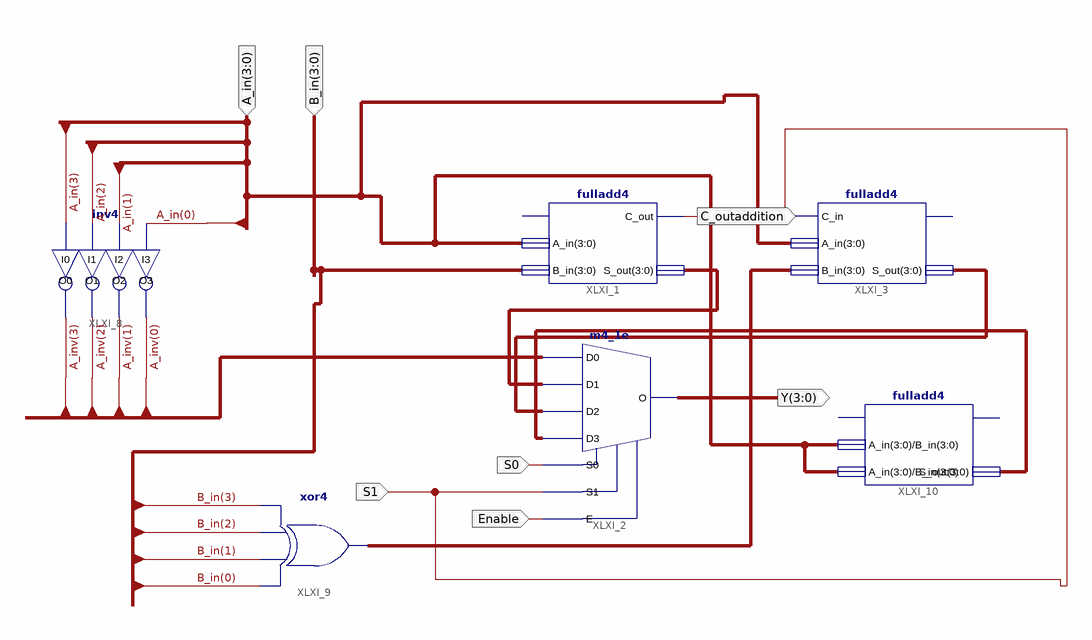
[diagram p0: schematic sheet 1]
// Xilinx ISE schematic lab1_ALU.sch (spartan6) as structural Verilog: 6 symbols, 7 ports
module lab1_ALU (
  input  [3:0] B_in,
  input  [3:0] A_in,
  input  S1,
  input  Enable,
  input  S0,
  output [3:0] Y,
  output C_outaddition
);

  wire [3:0] A_inv, XLXN_28, XLXN_38, XLXN_39, XLXN_41;

  fulladd4 XLXI_1 (.A_in(A_in), .B_in(B_in), .C_out(C_outaddition), .S_out(XLXN_28));  // open: C_in
  m4_1e XLXI_2 (.D0(A_inv), .D1(XLXN_28), .D2(XLXN_39), .D3(XLXN_41), .E(Enable), .S0(S0), .S1(S1), .O(Y));
  fulladd4 XLXI_3 (.C_in(S1), .A_in(A_in), .B_in(XLXN_38), .S_out(XLXN_39));  // open: C_out
  inv4 XLXI_8 (
    .I0(A_in[3]), .I1(A_in[2]), .I2(A_in[1]), .I3(A_in[0]), .O0(A_inv[3]), .O1(A_inv[2]), .O2(A_inv[1]),
    .O3(A_inv[0]));
  assign XLXN_38 = {4{B_in[0]}} ^ {4{B_in[1]}} ^ {4{B_in[2]}} ^ {4{B_in[3]}};  // xor4 XLXI_9, 4 bits wide
  fulladd4 XLXI_10 (.A_in(A_in), .B_in(A_in), .S_out(XLXN_41));  // open: C_in, C_out
endmodule
